# EAGLE design BedStrip (EAGLE 9.6.2)
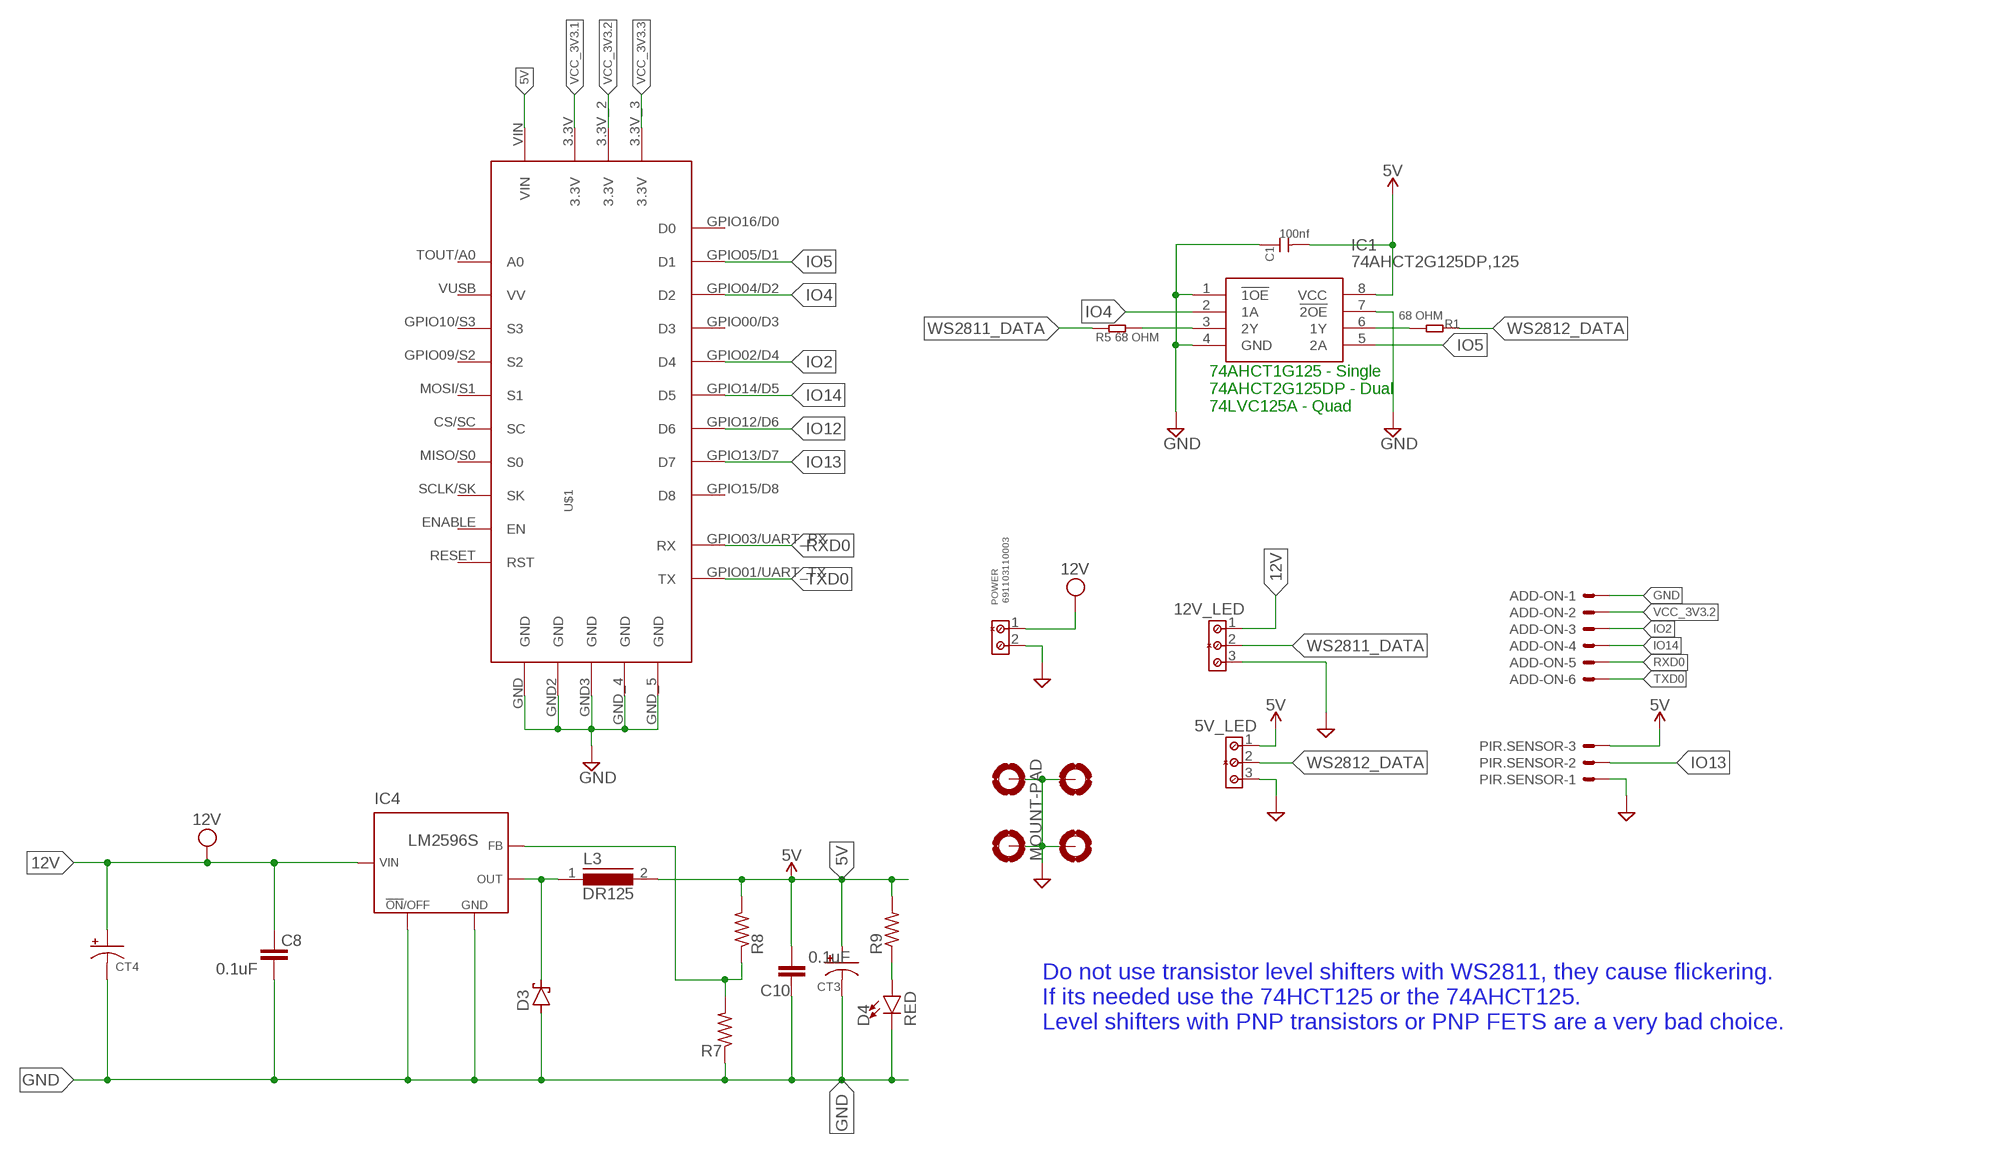
[diagram p0: schematic, sheet 1]

## Parts
5V_LED  691103110003  CONN-WR-TBL-3POS  [WR-TB_3.50-3.81_3POS]
12V_LED  691103110003  CONN-WR-TBL-3POS  [WR-TB_3.50-3.81_3POS]
ADD-ON  JST-XH-06-PIN-VERT-ROUND-PAD  [JST-XH-06-VERT-ROUND-PAD]
C1  100nf  CERAMIC-100NF-50V-10%-X7R(0603)  [C0603]
C8  0.1uF  C_CHIP-0603(1608-METRIC)  [CAPC1608X85]
C10  0.1uF  C_CHIP-0603(1608-METRIC)  [CAPC1608X85]
CT3  220UF  C-POL-US_ECAP-8.5MM  [CAPAE830X1050N]
CT4  220UF  C-POL-US_ECAP-8.5MM  [CAPAE830X1050N]
D3  SCHOTTKY-DIODESMD  [SMB]
D4  RED  LED-RED0603  [LED-0603]
H1  MOUNT-PAD-ROUND3.2  [3,2-PAD]
H2  MOUNT-PAD-ROUND3.2  [3,2-PAD]
H3  MOUNT-PAD  MOUNT-PAD-ROUND3.2  [3,2-PAD]
H4  MOUNT-PAD-ROUND3.2  [3,2-PAD]
IC1  74AHCT2G125DP,125  [SOP65P400X110-8N]
IC4  LM2596S  [TO263-5]
L3  DR125  [DR125]
PIR.SENSOR  JST-XH-03-PIN-VERT-ROUND-PAD  [JST-XH-03-VERT-ROUND-PAD]
POWER  691103110003  CONN-WR-TBL-2POS  [WR-TB_3.50-3.81_2POS]
R1  68 OHM  SMD-RES-68R-1%-1/10W(0603)  [R0603]
R5  68 OHM  SMD-RES-68R-1%-1/10W(0603)  [R0603]
R7  R-US_R0603  [R0603]
R8  R-US_R0603  [R0603]
R9  R-US_R0603  [R0603]
U$1  DEVBOARD_ESP8266_NODEMCU_V3DEVBOARD  [DEVBOARD_ESP8266_NODEMCU_V3]

## Nets
5V [LV]: 5V_LED.1 C1.2 C10.1 CT3.1(+) IC1.8(VCC) L3.2 PIR.SENSOR.3 R8.2 R9.2 U$1.VIN
12V [HV]: 12V_LED.1 C8.2 CT4.1(+) IC4.1(VIN) POWER.1
GND [HV]: 5V_LED.3 12V_LED.3 ADD-ON.1 C1.1 C8.1 C10.2 CT3.2(-) CT4.2(-) D3.A D4.C H1.B3,2(MOUNT) H2.B3,2(MOUNT) H3.B3,2(MOUNT) H4.B3,2(MOUNT) IC1.1(!1OE) IC1.4(GND) IC1.7(!2OE) IC4.3(GND) IC4.5(!ON!/OFF) IC4.6(GND) PIR.SENSOR.1 POWER.2 R7.1 U$1.GND U$1.GND2(GND) U$1.GND3(GND) U$1.GND_4(GND) U$1.GND_5(GND)
IO2 [signal]: ADD-ON.3 U$1.GPIO02/D4(D4)
IO4 [signal]: IC1.2(1A) U$1.GPIO04/D2(D2)
IO5 [signal]: IC1.5(2A) U$1.GPIO05/D1(D1)
IO12 [signal]: U$1.GPIO12/D6(D6)
IO13 [signal]: PIR.SENSOR.2 U$1.GPIO13/D7(D7)
IO14 [signal]: ADD-ON.4 U$1.GPIO14/D5(D5)
N$1 [signal]: IC1.6(1Y) R1.2
N$4: D3.C IC4.2(OUT) L3.1
N$5: D4.A R9.1
N$7: IC4.4(FB) R7.2 R8.1
N$12 [signal]: IC1.3(2Y) R5.2
RXD0 [signal]: ADD-ON.5 U$1.GPIO03/UART_RX(RX)
TXD0 [signal]: ADD-ON.6 U$1.GPIO01/UART_TX(TX)
VCC_3V3.1: U$1.3.3V
VCC_3V3.2 [LV]: ADD-ON.2 U$1.3.3V_2(3.3V)
VCC_3V3.3: U$1.3.3V_3(3.3V)
WS2811_DATA [signal]: 12V_LED.2 R5.1
WS2812_DATA [signal]: 5V_LED.2 R1.1
Unconnected: U$1.CS/SC(SC) U$1.ENABLE(EN) U$1.GPIO00/D3(D3) U$1.GPIO09/S2(S2) U$1.GPIO10/S3(S3) U$1.GPIO15/D8(D8) U$1.GPIO16/D0(D0) U$1.MISO/S0(S0) U$1.MOSI/S1(S1) U$1.RESET(RST) U$1.SCLK/SK(SK) U$1.TOUT/A0(A0) U$1.VUSB(VV)

## Notes on the sheet
- 74AHCT1G125 - Single
  74AHCT2G125DP - Dual
  74LVC125A - Quad
- Do not use transistor level shifters with WS2811, they cause flickering.
  If its needed use the 74HCT125 or the 74AHCT125.
  Level shifters with PNP transistors or PNP FETS are a very bad choice.

## Library data of the parts
5V_LED 12V_LED = CustomParts-Josh:CONN-WR-TBL-3POS: WR-TBL Serie 1031 - 3.50-3.81 mm Term Block KIND PROPERTIES Pitch 3.5 to 3.81 mm MATERIAL PROPERTIES Insulator Material PA66 Insulator Flammability Rating UL94 V-0 Insulator Color Blue Contact Material Brass Contact Plating Copper over Zinc Terminal Screw Material Steel Terminal Screw Plating Zinc Wire Guard Material Stainless Steel GENERAL INFORMATION Operating Temperature -40 up to +105 °C Compliance Lead free / RoHS ELECTRICAL PROPERTIES IR UL 10 A Working Voltage [UL] 125 V (AC) Withstanding Voltage [UL] 1250 V (AC) Contact Resistance 20 mΩ Contact Resistance [UL] 20 mΩ MECHANICAL PROPERTIES Wire Strip Length 5 up to 6 (mm) Screw M2 Solid Wire Section (AWG) 26 to 16 (AWG) Solid Wire Section (Metric) 0.129 to 1.31 (mm²) Stranded Wire Section (AWG) 26 to 16 (AWG) Stranded Wire Section (Metric) 0.129 to 1.31 (mm²) CERTIFICATION UL Approval E315414 PACKAGING PROPERTIES Packaging Box <https://katalog.we-online.com/media/images/v2/o33226v209%20Family_WR-TBL_69110311000x.jpg> Details see: https://katalog.we-online.com/en/em/TBL_3_50_1031_6911031100XX Updated by Ella Wu 2019-11-07 2019(C) Wurth Elektronik; DATASHEET-URL: https://www.we-online.com/catalog/datasheet/691103110003.pdf; IR-UL: 10A; MOUNT: THT; PART-NUMBER: 691103110003; PINS: 3; PITCH: 3.5mm; TYPE: Horizontal; WIRE: 26 to 16 (AWG) 0.129 to 1.31 (mm²); WORKING-VOLTAGE-UL: 125V(AC)
ADD-ON = JST XH Connectors:JST-XH-06-PIN: JST XH Connector 6 Pin Datasheet: https://www.jst-mfg.com/product/pdf/eng/eXH.pdf Wire to board connector. 2.50mm Pitch Number of pins: 6
C1 = OPL_Capacitor:CERAMIC-100NF-50V-10%-X7R(0603): 302010138; MPN: CC0603KRX7R9BB104
C8 C10 = Capacitor:C: Capacitor - Generic; CATEGORY: Capacitor
CT3 CT4 = Capacitor:C-POL-US: Capacitor Polarised - ANSI; CATEGORY: Capacitor
D3 = diode:SCHOTTKY-DIODE: Schottky Diode
D4 = SparkFun-LED:LED-RED: Red SMD LED Used in manufacturing of most products at SparkFun Packages: 0603 - SMD 0603 package [Product Link] <http://docs.avagotech.com/docs/AV02-0551EN> 0603 SMART - SMD 0603 SMART package ( more efficient and expensive)[Product Link] <http://www.osram-os.com/Graphics/XPic2/00077099_0.pdf> 1206 - SMD1206 package [Product Link] <https://www.sparkfun.com/datasheets/DevTools/LilyPad/Q150OVS4.pdff> SparkFun Products: Pro Mini 328 -5V <https://www.sparkfun.com/products/821> RedBoard <https://www.sparkfun.com/products/12757> IOIO-OTG <https://www.sparkfun.com/products/13613>; PROD_ID: DIO-00819
H1-H4 = holes:MOUNT-PAD-ROUND: MOUNTING PAD, round
IC1 = SamacSys_Parts:74AHCT2G125DP,125: 74AHC(T)2G125 - Dual buffer/line driver; 3-state@en-us Source: Datasheet <https://assets.nexperia.com/documents/data-sheet/74AHC_AHCT2G125.pdf>; DESCRIPTION: 74AHC(T)2G125 - Dual buffer/line driver; 3-state@en-us; HEIGHT: 1.1mm; MANUFACTURER_NAME: Nexperia; MANUFACTURER_PART_NUMBER: 74AHCT2G125DP,125; MOUSER_PART_NUMBER: 771-AHCT2G125DP125; MOUSER_PRICE-STOCK: https://www.mouser.co.uk/ProductDetail/Nexperia/74AHCT2G125DP125?qs=P62ublwmbi%2FS7fXZumeLoQ%3D%3D
IC4 = CustomParts-Josh:LM2596: SIMPLE SWITCHER® Power Converter 150 kHz 3A Step-Down Voltage Regulator Source: http://www.national.com/ds/LM/LM2596.pdf; MF: NATIONAL SEMICONDUCTOR; MPN: LM2596S-ADJ/NOPB; OC_FARNELL: 9494367; OC_NEWARK: 41K3842
L3 = inductors:DR125: High Power Density, High Efficiency, Shielded Inductors Source: coiltronics_dr_series.pdf; SPICEPREFIX: L
PIR.SENSOR = JST XH Connectors:JST-XH-03-PIN: JST XH Connector 3 Pin Datasheet: https://www.jst-mfg.com/product/pdf/eng/eXH.pdf Wire to board connector. 2.50mm Pitch Number of pins: 3
POWER = CustomParts-Josh:CONN-WR-TBL-2POS: WR-TBL Serie 1031 - 3.50-3.81 mm Term Block KIND PROPERTIES Pitch 3.5 to 3.81 mm MATERIAL PROPERTIES Insulator Material PA66 Insulator Flammability Rating UL94 V-0 Insulator Color Blue Contact Material Brass Contact Plating Copper over Zinc Terminal Screw Material Steel Terminal Screw Plating Zinc Wire Guard Material Stainless Steel GENERAL INFORMATION Operating Temperature -40 up to +105 °C Compliance Lead free / RoHS ELECTRICAL PROPERTIES IR UL 10 A Working Voltage [UL] 125 V (AC) Withstanding Voltage [UL] 1250 V (AC) Contact Resistance 20 mΩ Contact Resistance [UL] 20 mΩ MECHANICAL PROPERTIES Wire Strip Length 5 up to 6 (mm) Screw M2 Solid Wire Section (AWG) 26 to 16 (AWG) Solid Wire Section (Metric) 0.129 to 1.31 (mm²) Stranded Wire Section (AWG) 26 to 16 (AWG) Stranded Wire Section (Metric) 0.129 to 1.31 (mm²) CERTIFICATION UL Approval E315414 PACKAGING PROPERTIES Packaging Box <https://katalog.we-online.com/media/images/v2/o33226v209%20Family_WR-TBL_69110311000x.jpg> Details see: https://katalog.we-online.com/en/em/TBL_3_50_1031_6911031100XX Updated by Ella Wu 2019-11-07 2019(C) Wurth Elektronik; DATASHEET-URL: https://www.we-online.com/catalog/datasheet/691103110003.pdf; IR-UL: 10A; MOUNT: THT; PART-NUMBER: 691103110003; PINS: 3; PITCH: 3.5mm; TYPE: Horizontal; WIRE: 26 to 16 (AWG) 0.129 to 1.31 (mm²); WORKING-VOLTAGE-UL: 125V(AC)
R1 R5 = OPL_Resistor:SMD-RES-68R-1%-1/10W(0603): 301012094; MPN: RC0603FR-071K5L; VALUE: 1.5K
R7-R9 = resistor:R-US_: RESISTOR, American symbol
U$1 = CustomParts-Josh:DEVBOARD_ESP8266_NODEMCU_V3

## Net classes
0 default: width 0.152 mm
1 LV: width 0.254 mm, clearance 0.127 mm
2 signal: width 0.003 mm, clearance 0.051 mm
3 HV: width 0.254 mm, clearance 0.127 mm

## Board
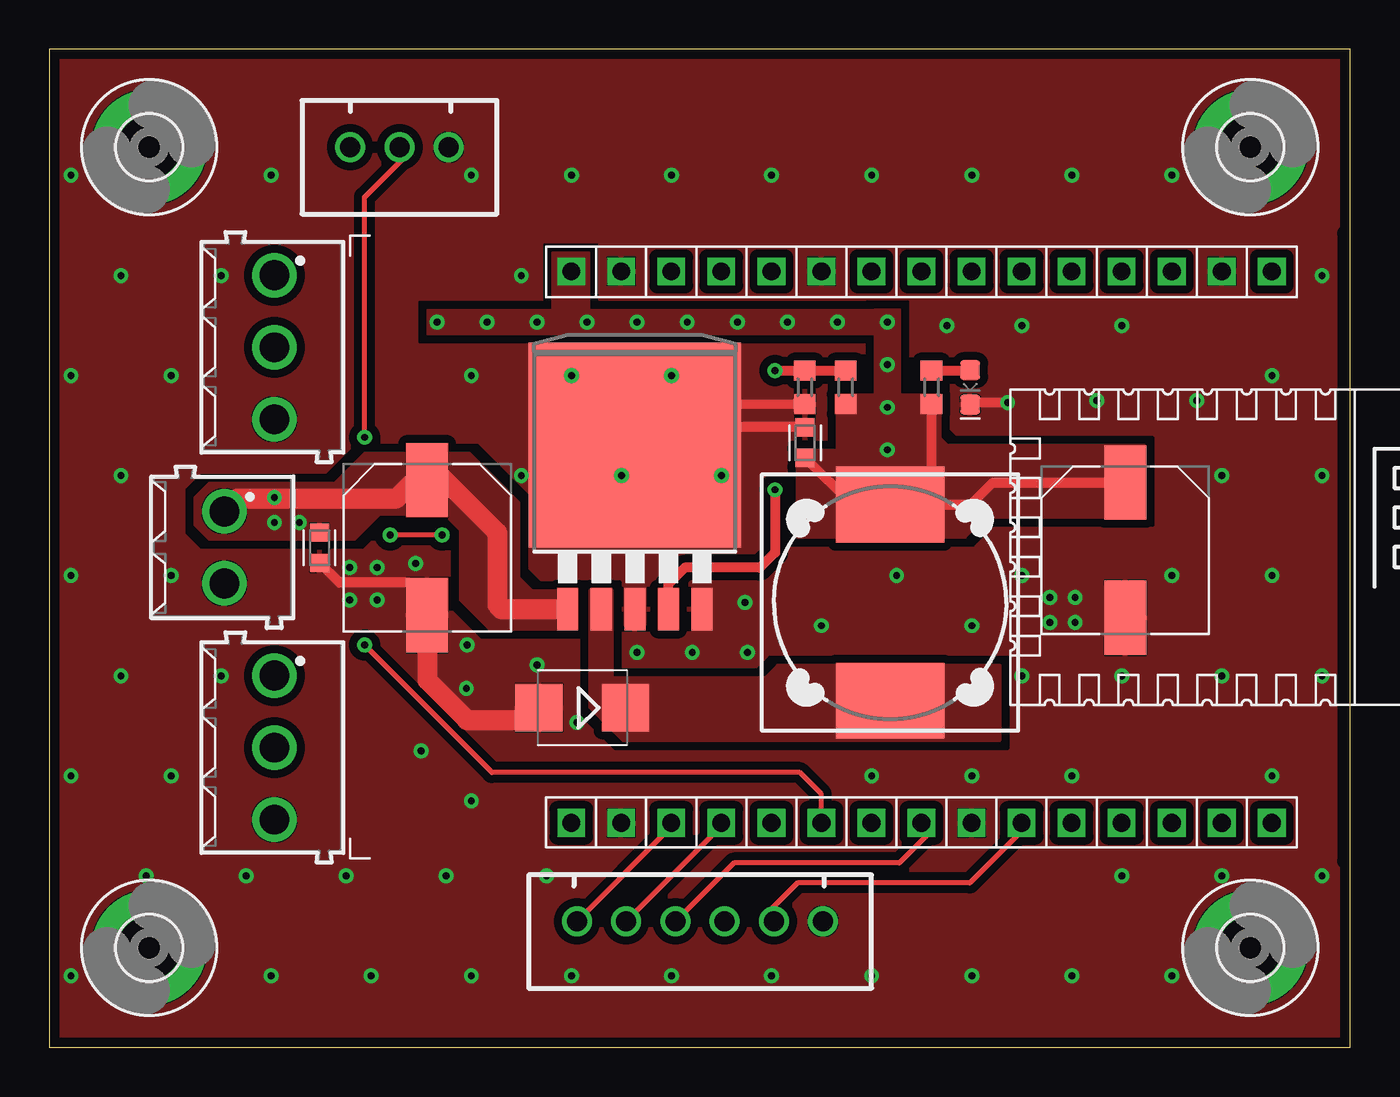
[diagram p1: board, top side]
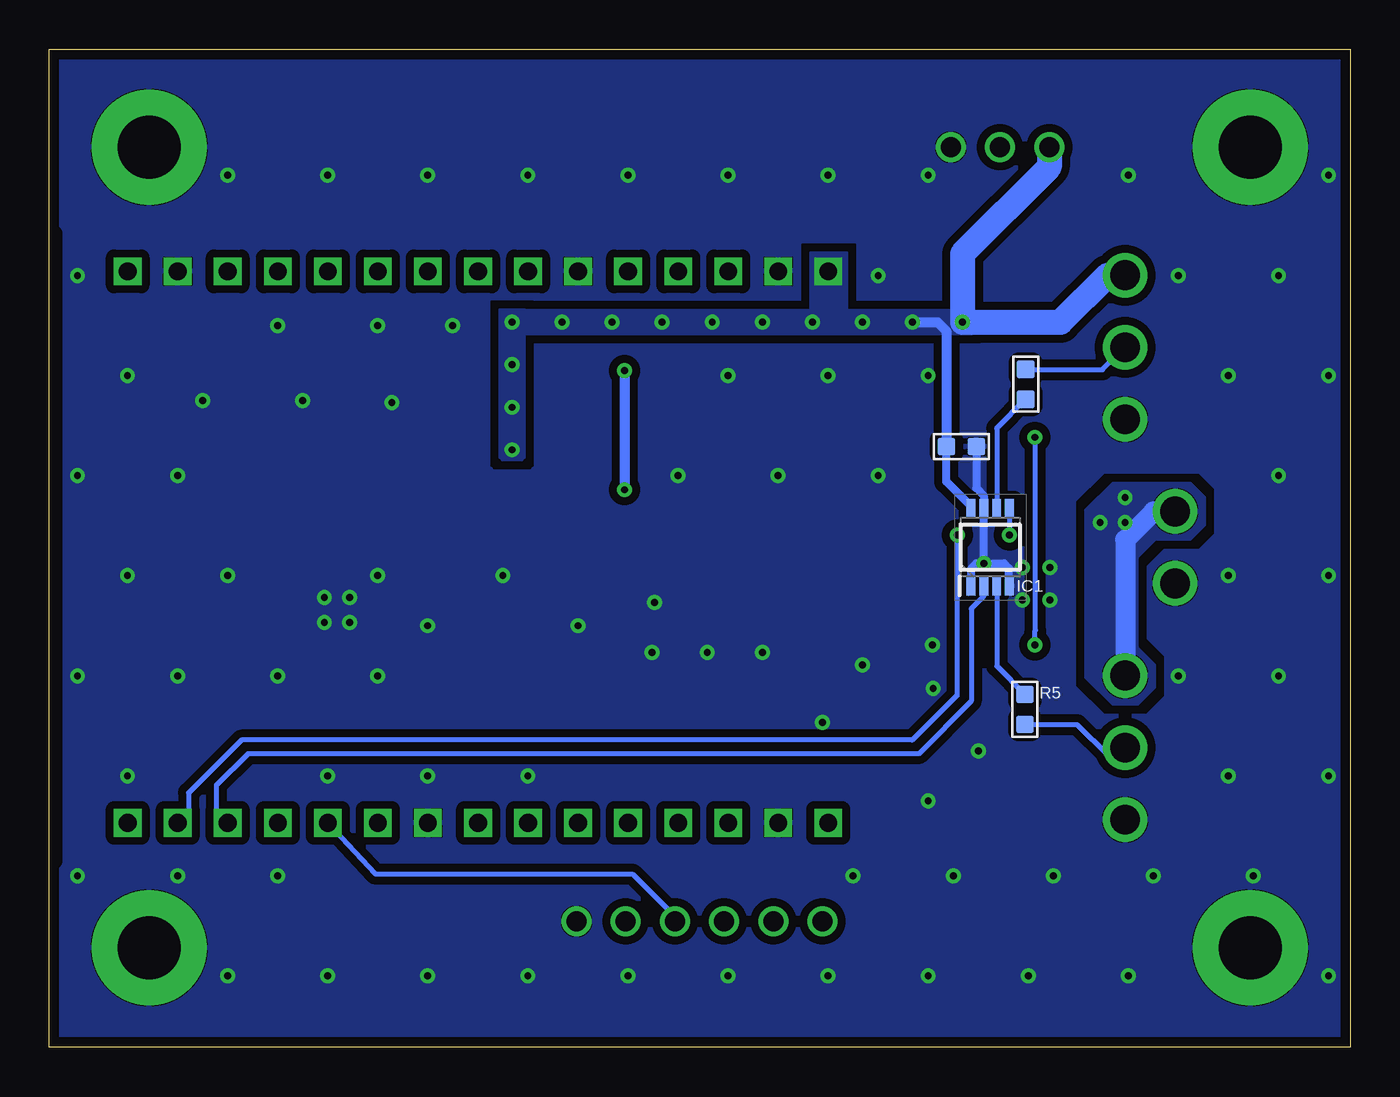
[diagram p2: board, bottom side, seen from below]

Size 66.03 x 50.67 mm. Coordinates in mm from the lower left corner, seen from the top.
Outline: 66.03,50.67 0,50.67 0,0 66.03,0 66.03,50.67
Copper layers (1*16): Top 0.035mm / dielectric 1.5mm / Bottom 0.035mm
Design rules "default *": minimum track width 6mil, minimum drill 0.35mm, track to track 6mil, track to pad 6mil, pad to pad 6mil, via to via 6mil, smd to smd 0mil, copper to edge 20mil, drill to drill 6mil, minimum pad ring 10mil, minimum via ring 8mil, stop-mask expansion 4mil, vias tented up to drill 2mm, thermal gap 2mil

### Footprints (pad centres in the part's own frame; a part is rotated, then mirrored left to right if it is on the bottom)
WR-TB_3.50-3.81_3POS = drill 1.51: 1 -3.655,0; 2 0,0; 3 3.655,0
JST-XH-06-VERT-ROUND-PAD = drill 1.016: 1 -6.25,0; 2 -3.75,0; 3 -1.25,0; 4 1.25,0; 5 3.75,0; 6 6.25,0
C0603 = smd 0.889 x 0.889: 1 0,0.762; 2 0,-0.762
CAPC1608X85 = smd 0.921 x 0.97: 1 -0.775,0; 2 0.775,0
CAPAE830X1050N = smd 3.764 x 2.115: 1 -3.426,0; 2 3.426,0
SMB = smd 2.4 x 2.4: A 2.2,0; C -2.2,0
LED-0603 = smd 1 x 1: A -0.877,0; C 0.877,0
3,2-PAD = drill 3.2 pad 5.842: B3,2 0,0
SOP65P400X110-8N = smd 0.95 x 0.45: 1 -1.975,0.975; 2 -1.975,0.325; 3 -1.975,-0.325; 4 -1.975,-0.975; 5 1.975,-0.975; 6 1.975,-0.325; 7 1.975,0.325; 8 1.975,0.975
TO263-5 = smd 1.067 x 2.159: 1 -3.404,-5.791; 2 -1.702,-5.791; 3 0,-5.791; 4 1.702,-5.791; 5 3.404,-5.791 | smd 10.8 x 10.41: 6 0,2.54
DR125 = smd 3.85 x 5.5: 1 -4.975,0; 2 4.975,0
JST-XH-03-VERT-ROUND-PAD = drill 1.016: 1 -2.5,0; 2 0,0; 3 2.5,0
WR-TB_3.50-3.81_2POS = drill 1.51: 1 -1.827,0; 2 1.827,0
R0603 = smd 0.889 x 0.889: 1 0,0.762; 2 0,-0.762
R0603' = smd 1 x 1.1: 1 -0.85,0; 2 0.85,0
DEVBOARD_ESP8266_NODEMCU_V3 = drill 0.9 square: 3.3V -14,-7.62; 3.3V_2 14,5.08; 3.3V_3 14,-17.78; CS/SC -14,2.54; ENABLE -14,-10.16; GND -14,15.24; GND2 -14,-5.08; GND3 -14,-15.24; GND_4 14,2.54; GND_5 14,-15.24; GPIO00/D3 14,10.16; GPIO01/UART_TX 14,-12.7; GPIO02/D4 14,7.62; GPIO03/UART_RX 14,-10.16; GPIO04/D2 14,12.7; GPIO05/D1 14,15.24; GPIO09/S2 -14,7.62; GPIO10/S3 -14,10.16; GPIO12/D6 14,-2.54; GPIO13/D7 14,-5.08; GPIO14/D5 14,0; GPIO15/D8 14,-7.62; GPIO16/D0 14,17.78; MISO/S0 -14,0; MOSI/S1 -14,5.08; RESET -14,-12.7; SCLK/SK -14,-2.54; TOUT/A0 -14,17.78; VIN -14,-17.78; VUSB -14,12.7

### Placement (x,y rotation side)
5V_LED  11.43,35.54 270 top
12V_LED  11.43,15.22 270 top
ADD-ON  33.03,6.4 180 top
C1  19.74,30.49 270 bottom
C8  13.72,25.37 90 top
C10  38.36,30.7 90 top
CT3  54.61,25.24 270 top
CT4  19.18,25.37 270 top
D3  27.05,17.24 180 top
D4  46.74,33.51 270 top
H1  60.96,5.06 180 top
H2  5.08,45.7 180 top
H3  5.08,5.06 180 top
H4  60.96,45.7 180 top
IC1  18.27,25.4 90 bottom
IC4  29.72,28.04 0 top
L3  42.67,22.57 90 top
PIR.SENSOR  17.78,45.7 180 top
POWER  8.89,25.38 270 top
R1  16.47,33.66 0 bottom
R5  16.51,17.15 180 bottom
R7  [R0603']  38.35,33.51 90 top
R8  [R0603']  40.42,33.51 270 top
R9  [R0603']  44.77,33.51 270 top
U$1  44.27,25.4 270 top

### Tracks (layer width: path | path; a pad name or v marks a point on that pad's centre or on a via)
5V  (via drill 0.35)
  Top 0.508: C10.1 38.39,29.93 40.77,27.55 L3.2 44.77,27.55 | CT3.1 47.88,28.67 46.77,27.55 44.77,27.55 | R9.2 44.77,27.55
  Bottom 0.406: IC1.8 19.24,27.48 20.51,28.71 C1.2
  Bottom 0.508: v22.22,36.81 20.95,36.81 20.5,36.36 C1.2
  Bottom 1.27: 5V_LED.1 12.31,39.2 14.7,36.81 v19.68,36.81 19.68,40.28 15.28,44.69 PIR.SENSOR.3
  other vias: 42.54,30.33 42.54,32.49 42.54,36.81 42.54,34.65 40,36.81 37.46,36.81 34.92,36.81 32.38,36.81 29.84,36.81 27.3,36.81 24.76,36.81
  pour Top (rank 5, no thermals): 46.48,25.88 37.97,25.88 37.97,30.33 40,30.33 40,33.13 45.21,33.13 45.21,30.96 45.59,30.58 55.6,30.58 55.6,26.89 47.5,26.89
  pour Bottom (rank 2): 43.18,37.45 43.18,29.95 43.05,29.83 42.03,29.83 41.91,29.95 41.91,37.45
  pour Top (rank 5): 19.17,37.45 43.18,37.45 43.18,36.18 19.17,36.18
  pour Bottom (rank 2): 19.17,37.45 43.18,37.45 43.18,36.18 19.17,36.18
  pour Top (rank 5): 43.18,37.45 43.18,29.83 41.91,29.83 41.91,37.45
  pour Top (no thermals): 25.52,36.18 25.52,40.37 27.43,40.37 27.43,36.18
  pour Bottom (no thermals): 25.52,36.18 25.52,40.37 27.43,40.37 27.43,36.18
12V  (via drill 0.35)
  Top 1.016: POWER.1 9.52,27.84 17.59,27.84 18.86,29.11 CT4.1 19.43,29.05 19.81,29.05 22.73,26.13 22.73,22.46 22.94,22.24 IC4.1
  Bottom 1.016: POWER.1 9.98,27.21 11.43,25.76 12V_LED.1
  other vias: 11.43,26.65 11.43,27.92 12.7,26.65
  pour Top (rank 2): 8.12,25.76 7.36,26.52 7.36,27.92 8.12,28.68 14.47,28.68 16,30.21 21.33,30.21 23.87,27.67 23.87,23.86 24.51,23.22 26.67,23.22 26.79,23.09 26.79,21.32 26.67,21.19 22.35,21.19 20.82,22.71 20.82,26.27 20.06,27.03 16.76,27.03 15.49,25.76
  pour Bottom: 9.9,18.27 9.9,19.41 10.79,20.3 10.79,24.87 9.9,25.76 8.12,25.76 7.36,26.52 7.36,27.92 8.12,28.68 12.06,28.68 13.46,27.29 13.46,18.78 12.06,17.38 10.79,17.38
GND  (via drill 0.35)
  Top 0.508: C10.2 30.62,31.48 IC4.6 31.78,32.64 R7.1 | v48.64,32.73 46.84,32.73 D4.C | C8.1 13.73,24.59 14.73,23.59 18.29,23.59 19.18,22.7 CT4.2
  Top 1.016: CT4.2 19.18,18.64 21.2,16.62 24.23,16.62 D3.A
  Bottom 0.406: C1.1 18.98,28.38 18.59,28 IC1.7 v18.59,24.57 | IC1.1 19.23,23.44 19.23,24.32 18.98,24.57 v18.59,24.57 | IC1.4 17.31,23.44 17.31,24.32 17.56,24.57 v18.59,24.57
  other vias: 24.76,19.41 26.79,16.49 21.2,20.43 16.63,22.71 15.24,24.36 15.24,22.71 16.63,24.36 35.43,20.05 29.84,20.05 32.63,20.05 35.3,22.59 52.07,22.84 50.8,22.84 50.8,21.57 52.07,21.57 1.1,3.63 1.1,13.79 1.1,23.95 1.1,34.11 1.1,44.27 4.91,8.71 6.18,13.79 3.64,18.87 6.18,23.95 3.64,29.03 6.18,34.11 3.64,39.19 11.26,3.63 9.99,8.71 8.72,18.87 8.72,39.19 11.26,44.27 16.34,3.63 15.07,8.71 18.88,15.06 21.42,3.63 20.15,8.71 21.42,12.52 21.42,34.11 21.42,44.27 26.5,3.63 25.23,8.71 21.17,18.23 23.96,29.03 26.5,34.11 23.96,39.19 26.5,44.27 31.58,3.63 29.04,29.03 31.58,34.11 45.55,36.65 31.58,44.27 36.66,3.63 39.2,21.41 34.12,29.03 36.66,44.27 41.74,3.63 41.74,13.79 43.01,23.95 49.36,36.65 41.74,44.27 46.82,3.63 46.82,13.79 46.82,21.41 46.82,44.27 51.9,3.63 51.9,13.79 49.36,18.87 49.36,23.95 53.17,32.84 51.9,44.27 56.98,3.63 54.44,8.71 54.44,18.87 56.98,23.95 58.25,32.84 56.98,44.27 59.52,8.71 62.06,13.79 59.52,18.87 62.06,23.95 59.52,29.03 62.06,34.11 54.44,36.65 64.6,8.71 64.6,18.87 64.6,29.03 64.6,39.19
  pour Top (no thermals): 29.21,21.43 29.21,26.38 30.23,26.38 30.23,21.43
  pour Top (no thermals): 38.23,31.72 34.04,31.72 34.04,31.21 38.23,31.21
  pour Top (no thermals): 38.23,32.86 34.04,32.86 34.04,32.35 38.23,32.35
  pour Top (no thermals): 54.48,20.92 54.48,23.34 32.64,23.34 32.64,20.92
  pour Top: 8.25,22.08 7.36,22.97 7.36,24.24 8.12,25 19.05,25 20.19,23.86 20.19,21.06 22.47,18.78 25.78,18.78 26.03,18.52 26.03,15.73 25.9,15.6 21.71,15.6 17.01,20.3 17.01,20.55 15.49,22.08
  pour Bottom (isolate 0.406, rank 6): 0,-1.29 67.31,-1.29 67.31,41.89 67.31,52.05 3.81,52.05 -1.27,52.05 -1.27,-1.29
  pour Top (isolate 0.406, rank 6): 0,-1.29 67.31,-1.29 67.31,41.89 67.31,52.05 3.81,52.05 -1.27,52.05 -1.27,-1.29
IO2
  Bottom 0.254: U$1.GPIO02/D4 49.48,8.81 36.44,8.81 34.28,6.65 ADD-ON.3
IO4
  Bottom 0.254: U$1.GPIO04/D2 57.17,11.65 57.55,12.03 57.55,13.3 55.94,14.91 21.9,14.91 19.23,17.58 19.23,22.28 18.59,22.91 IC1.2
IO5  (via drill 0.35)
  Top 0.254: v19.93,26.02 v17.29,26.02
  Bottom 0.254: U$1.GPIO05/D1 59.47,11.4 58.96,11.9 58.96,12.92 56.28,15.6 22.22,15.6 19.96,17.86 19.96,25.99 v19.93,26.02 | IC1.5 v17.29,26.02
IO13  (via drill 0.35)
  Top 0.254: U$1.GPIO13/D7 39.19,12.86 38.1,13.95 22.47,13.95 v16,20.43 | v16,30.97 16,43.16 17.9,45.07 17.9,45.57 PIR.SENSOR.2
  Bottom 0.254: v16,20.43 16,21.15 15.97,21.17 15.97,30.95 v16,30.97
IO14
  Top 0.254: U$1.GPIO14/D5 44.61,10.82 43.15,9.36 34.75,9.36 ADD-ON.4
N$1
  Bottom 0.254: IC1.6 17.95,31.43 R1.2
N$4
  pour Top (isolate 0.254, rank 2, no thermals): 27.43,23.21 27.43,17.25 29.1,15.59 48.26,15.59 48.26,19.4 36.96,19.4 36.32,18.77 28.58,18.77 28.58,23.21
N$5
  Top 0.508: R9.1 46.71,34.36 D4.A
N$7  (via drill 0.35)
  Top 0.508: IC4.4 31.42,23.52 32.26,24.35 36.07,24.35 36.84,25.12 v36.84,28.31 | R8.1 38.37,34.36 R7.2 v36.83,34.36
  Bottom 0.508: v36.83,34.36 v36.83,28.32 v36.84,28.31
N$12
  Bottom 0.254: IC1.3 17.95,19.36 R5.2
RXD0
  Top 0.254: U$1.GPIO03/UART_RX 34.22,11.34 ADD-ON.5
TXD0
  Top 0.254: U$1.GPIO01/UART_TX 31.67,11.29 ADD-ON.6
VCC_3V3.2
  Top 0.254: U$1.3.3V_2 49.52,11.14 46.73,8.35 37.97,8.35 36.65,7.03 36.65,6.52 ADD-ON.2
WS2811_DATA
  Bottom 0.254: R5.1 13.86,16.39 12.31,14.84 11.81,14.84 12V_LED.2
WS2812_DATA
  Bottom 0.254: R1.1 16.45,34.4 12.57,34.4 5V_LED.2

### Text on the board
silktop: 5V | SIG | G | 5V | DAT | GND | PWR | 12V IN | GND | 12V | DAT | GND | TX | RX | D5 | D4 | 3v3 | G